# Altium project base_power_assy PCB.PrjPCB
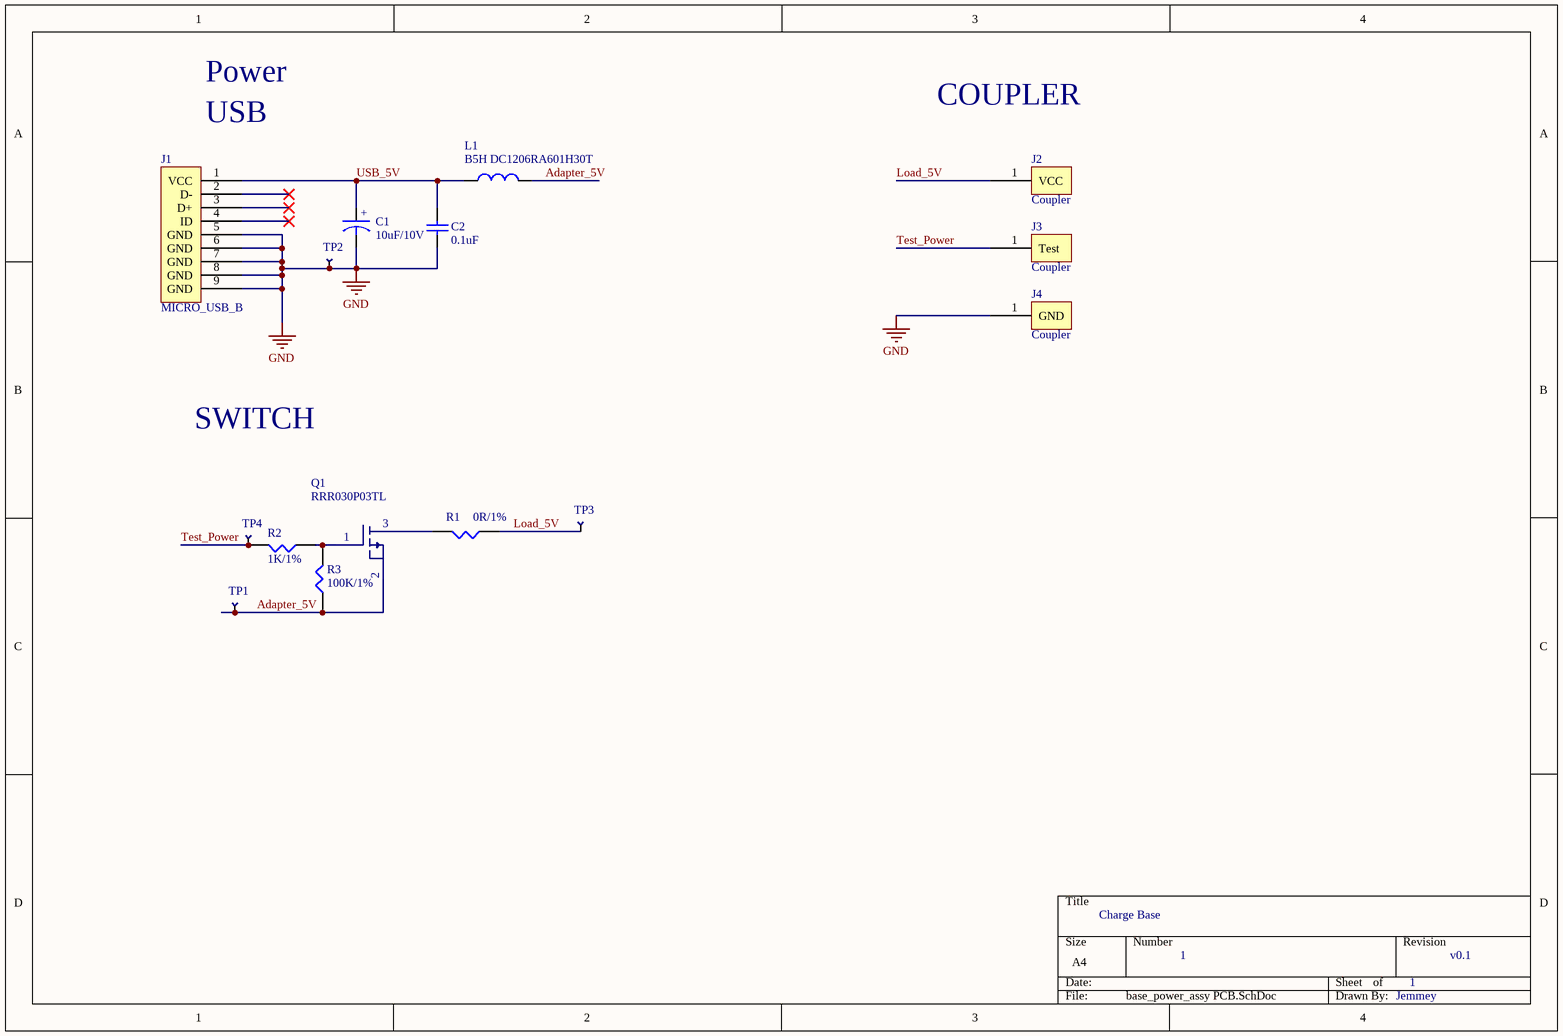
[diagram p0: base_power_assy PCB.SchDoc]
1 sheet, 15 parts. Net scope: global (net labels, ports and power ports of the same name join across sheets).
Board file: base_power_assy PCB.PcbDoc

## Sheet base_power_assy PCB.SchDoc
size A4

### Parts
C1  10uF/10V  [3216]
C2  0.1uF  [0402C]
J1  MICRO_USB_B  [Micro-USB-乐沪]
J2  Coupler  [Coupler - 1]
J3  Coupler  [Coupler - 1]
J4  Coupler  [Coupler - 1]
L1  B5H DC1206RA601H30T  [1206]
Q1  RRR030P03TL  [TSMT3]
R1  0R/1%  [0805]
R2  1K/1%  [0402R]
R3  100K/1%  [0402R]
TP1  TEST  [Test Pad]  (value not drawn)
TP2  TEST  [Test Pad]  (value not drawn)
TP3  TEST  [Test Pad]  (value not drawn)
TP4  TEST  [Test Pad]  (value not drawn)

### Nets
GND: C1.2 C2.1 J1.5(GND) J1.6(GND) J1.7(GND) J1.8(GND) J1.9(GND) J4.1(GND) TP2.1
Adapter_5V: L1.2 Q1.2(S) R3.1 TP1.1
Load_5V: J2.1(VCC) R1.1 TP3.1
Test_Power: J3.1(Test) R2.2 TP4.1
USB_5V: C1.1 C2.2 J1.1(VCC) L1.1
NetQ1_1: Q1.1(G) R2.1 R3.2
NetQ1_3: Q1.3(D) R1.2

Not connected (* = marked no-connect by the designer): J1 2(D-)* 3(D+)* 4(ID)*

### Notes on the sheet
- Power
- COUPLER
- (near J1) USB
- SWITCH
- Charge Base
- 1
- v0.1
- Jemmey
- (in symbol Capacitor) +

### Library data of the parts
C1 = Capacitor
C2 = Cap: Published: 8-Jun-2000; Revision: July-2002: Re-released for DXP Platform.; Publisher: Altium Limited
J1 = USB_B: 厂家：AVX，型号：20-6751-005-001-007
J2-J4 = Coupler: 厂家：待定；型号：待定
L1 = CHOKE: 厂家：宇磁，型号：B5H DC1206RA601H30T
Q1 = PMOS: 厂家：ROHM，型号：RRR030P03TL
R1 = RES1: 厂家：Yageo，型号：RC0402FR-070RL
R2 = RES: 厂家：Yageo，型号：RC0402FR-071KL
R3 = RES: 厂家：Yageo，型号：RC0402FR-07100KL
TP1-TP4 = TEST: Test Point